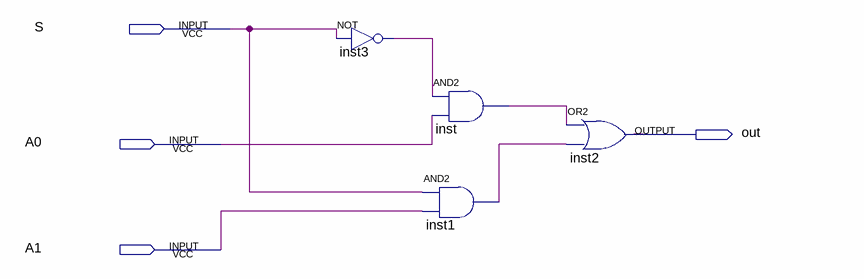
[diagram p0: schematic sheet]
// Quartus schematic mux.bdf as structural Verilog: 4 symbols, 4 pins
module mux (
  input  S,
  input  A0,
  input  A1,
  output out
);

  wire inst1_out, inst3_out, inst_out;

  not inst3 (inst3_out, S);
  and inst1 (inst1_out, S, A1);
  and inst (inst_out, inst3_out, A0);
  or inst2 (out, inst_out, inst1_out);
endmodule
